# EAGLE schematic STorM32 NT BGC v330m (EAGLE 7.5.0)
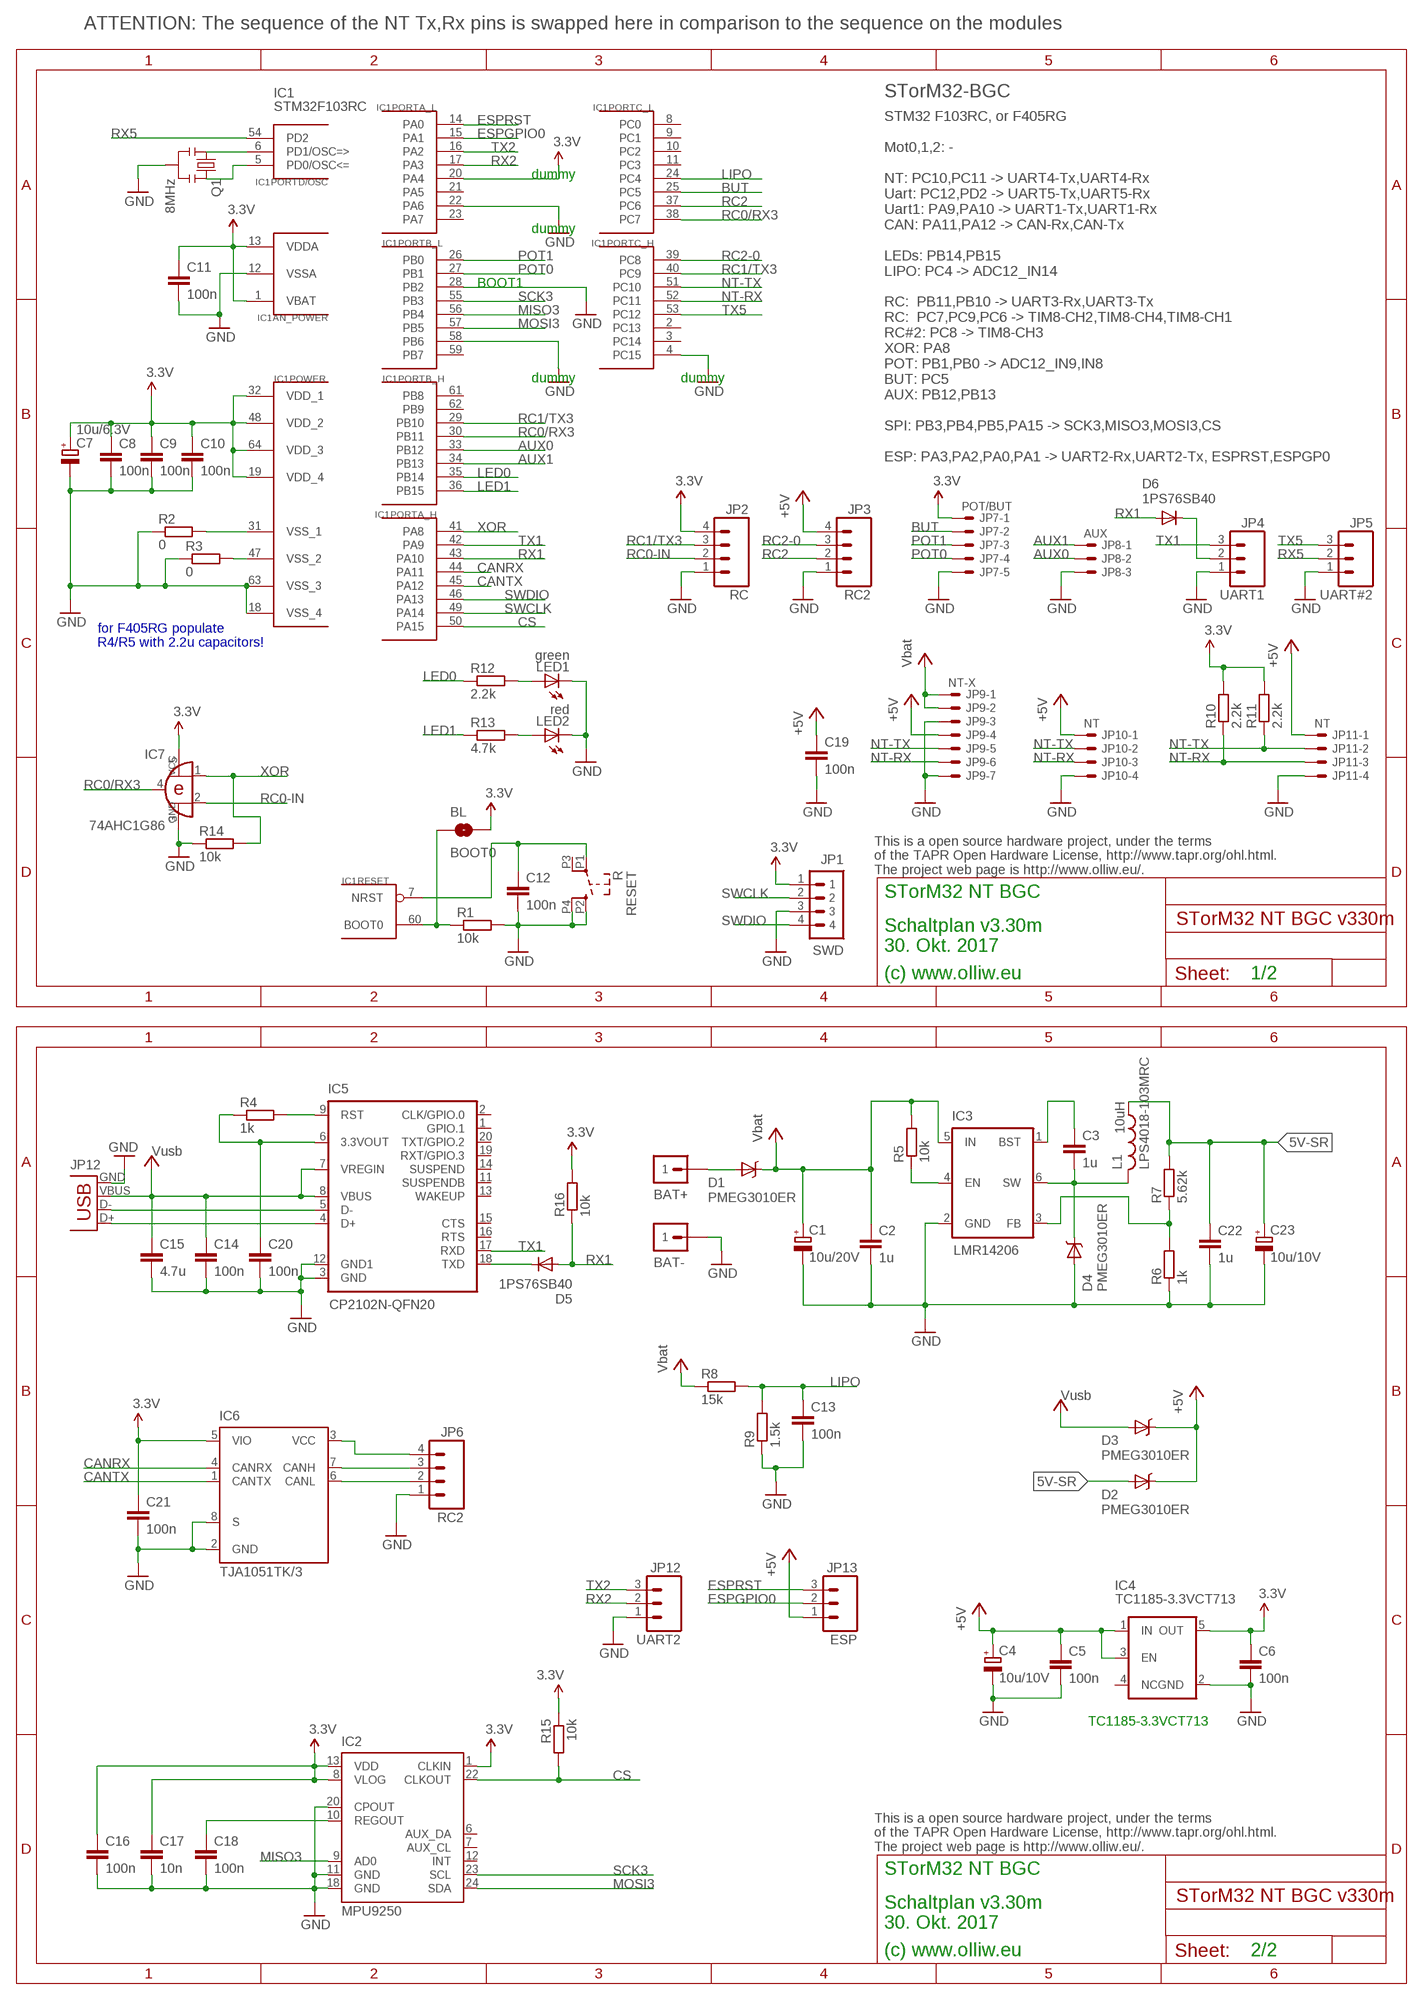
[diagram p0: schematic, sheet 1]

## Parts
BAT+  M1X1  [1X1_WITHOUT]
BAT-  M1X1  [1X1_WITHOUT]
BL  BOOT0  SOLDERJUMPERNO  [SJ_2S-NO]
C1  10u/20V  CPOL-EUSMCB  [SMC_B]
C2  1u  C-EUC0603  [C0603]
C3  1u  C-EUC0603  [C0603]
C4  10u/10V  CPOL-EUSMCA  [SMC_A]
C5  100n  C-EUC0603  [C0603]
C6  100n  C-EUC0402  [C0402]
C7  10u/6.3V  CPOL-EUSMCA  [SMC_A]
C8  100n  C-EUC0402  [C0402]
C9  100n  C-EUC0402  [C0402]
C10  100n  C-EUC0402  [C0402]
C11  100n  C-EUC0402  [C0402]
C12  100n  C-EUC0402  [C0402]
C13  100n  C-EUC0402  [C0402]
C14  100n  C-EUC0402  [C0402]
C15  4.7u  C-EUC0603  [C0603]
C16  100n  C-EUC0402  [C0402]
C17  10n  C-EUC0402  [C0402]
C18  100n  C-EUC0402  [C0402]
C19  100n  C-EUC0402  [C0402]
C20  100n  C-EUC0402  [C0402]
C21  100n  C-EUC0402  [C0402]
C22  1u  C-EUC0603  [C0603]
C23  10u/10V  CPOL-EUSMCA  [SMC_A]
D1  PMEG3010ER  DIODE-SCHOTTKYSOD123-W  [SOD123W-DIODE]
D2  PMEG3010ER  DIODE-SCHOTTKYSOD123-W  [SOD123W-DIODE]
D3  PMEG3010ER  DIODE-SCHOTTKYSOD123-W  [SOD123W-DIODE]
D4  PMEG3010ER  DIODE-SCHOTTKYSOD123-W  [SOD123W-DIODE]
D5  1PS76SB40  DIODE-SOD110-R  [SOD110-R]
D6  1PS76SB40  DIODE-SOD110-R  [SOD110-R]
IC1  STM32F103RCT6  STM32F10XRXT6  [TQFP64]
IC2  MPU9250  IMU3000QFN-24-0.4MIL  [QFN-24-3X3]
IC3  LMR14206  MP2359  [SOT23-6]
IC4  TC1185-3.3VCT713  V_REG_TPS76433SOT23-5  [SOT23-5]
IC5  CP2102N-QFN20  [QFN20-CP2102N]
IC6  TJA1051TK/3  [HVSON8]
IC7  74AHC1G86  [SOT23-5-VER1]
JP1  SWD  P4X1_1P27-OCT_BILEX  [4X1_1P27_OCT_BILEX]
JP2  RC  M041X04_NO_SILK  [1X04_NO_SILK]
JP3  RC2  M041X04_NO_SILK  [1X04_NO_SILK]
JP4  UART1  M031X03_NO_SILK  [1X03_NO_SILK]
JP5  UART#2  M031X03_NO_SILK  [1X03_NO_SILK]
JP6  RC2  M041X04_NO_SILK  [1X04_NO_SILK]
JP7  POT/BUT  SM05B-SRSS-TB  [SM05B-SRSS-TB]
JP8  AUX  SM03B-SRSS-TB  [SM03B-SRSS-TB]
JP9  NT-X  SM07B-SRSS-TB  [SM07B-SRSS-TB]
JP10  NT  SM04B-SRSS-TB  [SM04B-SRSS-TB]
JP11  NT  SM04B-SRSS-TB  [SM04B-SRSS-TB]
JP12  UART2  M031X03_NO_SILK  [1X03_NO_SILK]
JP13  ESP  M031X03_NO_SILK  [1X03_NO_SILK]
L1  LPS4018-103MRC  L  [L4X4]
LED1  green  LEDCHIPLED_0603  [CHIPLED_0603]
LED2  red  LEDCHIPLED_0603  [CHIPLED_0603]
Q1  8MHz  RESONATORSMD  [RESONATOR-SMD]
R1  10k  R-EU_R0402  [R0402]
R2  0  R-EU_R0402  [R0402]
R3  0  R-EU_R0402  [R0402]
R4  1k  R-EU_R0402  [R0402]
R5  10k  R-EU_R0402  [R0402]
R6  1k  R-EU_R0402  [R0402]
R7  5.62k  R-EU_R0402  [R0402]
R8  15k  R-EU_R0402  [R0402]
R9  1.5k  R-EU_R0402  [R0402]
R10  2.2k  R-EU_R0402  [R0402]
R11  2.2k  R-EU_R0402  [R0402]
R12  2.2k  R-EU_R0402  [R0402]
R13  4.7k  R-EU_R0402  [R0402]
R14  10k  R-EU_R0402  [R0402]
R15  10k  R-EU_R0402  [R0402]
R16  10k  R-EU_R0402  [R0402]
RESET  R  SWITCH-SMD-RIGHT-TL1014  [TACTILE-SWITCH-SMD-RIGHT-TL1014]
USB  Amphenol 10118192-0001LF  USB-MICROB  [USB-MICROB]

## Nets
3.3V: BL.2 C6.1 C7.+ C8.1 C9.1 C10.1 C11.1 C16.1 C17.1 C21.1 IC1.1(AN_POWER:VBAT) IC1.13(AN_POWER:VDDA) IC1.19(POWER:VDD_4) IC1.20(PORTA_L:PA4) IC1.32(POWER:VDD_1) IC1.48(POWER:VDD_2) IC1.64(POWER:VDD_3) IC2.1(CLKIN) IC2.8(VLOG) IC2.13(VDD) IC4.5(OUT) IC6.5(VIO) IC7.5(VCC) JP1.1 JP2.4 JP7.1 R10.2 R11.2 R15.1 R16.2
3.3V-CP2102: C20.1 IC5.6(3.3VOUT) R4.1
5V-CAN-RAW: IC6.3(VCC) JP6.4
5V-SR: C22.1 C23.+ D2.A L1.1 R7.2
+5V: C4.+ C5.1 C19.1 D2.C D3.C IC4.1(IN) IC4.3(EN) JP3.4 JP9.4 JP10.1 JP11.1 JP13.1
AUX0: IC1.33(PORTB_H:PB12) JP8.2
AUX1: IC1.34(PORTB_H:PB13) JP8.1
BATP: BAT+.1 D1.A
BOOT0: BL.1 IC1.60(RESET:BOOT0) R1.1
BUT: IC1.25(PORTC_L:PC5) JP7.2
CANH: IC6.7(CANH) JP6.3
CANL: IC6.6(CANL) JP6.2
CANRX: IC1.44(PORTA_H:PA11) IC6.4(CANRX)
CANTX: IC1.45(PORTA_H:PA12) IC6.1(CANTX)
CS: IC1.50(PORTA_H:PA15) IC2.22(CLKOUT) R15.2
ESPGPIO0: IC1.15(PORTA_L:PA1) JP13.2
ESPRST: IC1.14(PORTA_L:PA0) JP13.3
GND: BAT-.1 C1.- C2.2 C4.- C5.2 C6.2 C7.- C8.2 C9.2 C10.2 C11.2 C12.2 C13.2 C14.2 C15.2 C16.2 C17.2 C18.2 C19.2 C20.2 C21.2 C22.2 C23.- D4.A IC1.4(PORTC_H:PC15) IC1.12(AN_POWER:VSSA) IC1.18(POWER:VSS_4) IC1.22(PORTA_L:PA6) IC1.28(PORTB_L:PB2) IC1.58(PORTB_L:PB6) IC1.63(POWER:VSS_3) IC2.11(GND) IC2.18(GND) IC2.20(CPOUT) IC3.2(GND) IC4.2(GND) IC5.3(GND) IC5.12(GND1) IC6.2(GND) IC6.8(S) IC7.3(GND) JP1.3 JP2.1 JP3.1 JP4.1 JP5.1 JP6.1 JP7.5 JP8.3 JP9.3 JP9.7 JP10.4 JP11.4 JP12.1 LED1.C LED2.C Q1.2 R1.2 R2.1 R3.1 R6.1 R9.1 R14.1 RESET.P2 RESET.P4 USB.GND
LED0: IC1.35(PORTB_H:PB14) R12.1
LED1: IC1.36(PORTB_H:PB15) R13.1
LIPO: C13.1 IC1.24(PORTC_L:PC4) R8.2 R9.2
MISO3: IC1.56(PORTB_L:PB4) IC2.9(AD0)
MOSI3: IC1.57(PORTB_L:PB5) IC2.24(SDA)
N$5: IC5.5(D-) USB.D-
N$6: IC5.4(D+) USB.D+
N$7: IC3.4(EN) R5.1
N$8: LED1.A R12.2
N$9: LED2.A R13.2
N$10: IC1.47(POWER:VSS_2) R3.2
N$11: IC1.5(PORTD/OSC:PD0/OSC<=) Q1.3
N$12: IC1.6(PORTD/OSC:PD1/OSC=>) Q1.1
N$13: C3.1 IC3.1(BST)
N$14: IC3.3(FB) R6.2 R7.1
N$15: C3.2 D4.C IC3.6(SW) L1.2
N$16: D5.C IC5.18(TXD)
N$17: D6.C JP4.2
N$18: IC5.9(RST) R4.2
N$26: IC1.31(POWER:VSS_1) R2.2
NRST: C12.1 IC1.7(RESET:NRST) RESET.P1
NT-RX: IC1.52(PORTC_H:PC11) JP9.6 JP10.3 JP11.3 R10.1
NT-TX: IC1.51(PORTC_H:PC10) JP9.5 JP10.2 JP11.2 R11.1
POT0: IC1.27(PORTB_L:PB1) JP7.4
POT1: IC1.26(PORTB_L:PB0) JP7.3
RC0-IN: IC7.2(I1) JP2.2
RC0/RX3: IC1.30(PORTB_H:PB11) IC1.38(PORTC_L:PC7) IC7.4(O)
RC1/TX3: IC1.29(PORTB_H:PB10) IC1.40(PORTC_H:PC9) JP2.3
RC2: IC1.37(PORTC_L:PC6) JP3.2
RC2-0: IC1.39(PORTC_H:PC8) JP3.3
REGOUT: C18.1 IC2.10(REGOUT)
RX1: D5.A D6.A IC1.43(PORTA_H:PA10) R16.1
RX2: IC1.17(PORTA_L:PA3) JP12.2
RX5: IC1.54(PORTD/OSC:PD2) JP5.2
SCK3: IC1.55(PORTB_L:PB3) IC2.23(SCL)
SWCLK: IC1.49(PORTA_H:PA14) JP1.2
SWDIO: IC1.46(PORTA_H:PA13) JP1.4
TX1: IC1.42(PORTA_H:PA9) IC5.17(RXD) JP4.3
TX2: IC1.16(PORTA_L:PA2) JP12.3
TX5: IC1.53(PORTC_H:PC12) JP5.3
VCC: C1.+ C2.1 D1.C IC3.5(IN) JP9.1 JP9.2 R5.2 R8.1 ; supply symbol labelled Vbat
VUSB: C14.1 C15.1 D3.A IC5.7(VREGIN) IC5.8(VBUS) USB.VBUS ; supply symbol labelled Vusb
XOR: IC1.41(PORTA_H:PA8) IC7.1(I0) R14.2
Unconnected: IC1.2(PORTC_H:PC13) IC1.3(PORTC_H:PC14) IC1.8(PORTC_L:PC0) IC1.9(PORTC_L:PC1) IC1.10(PORTC_L:PC2) IC1.11(PORTC_L:PC3) IC1.21(PORTA_L:PA5) IC1.23(PORTA_L:PA7) IC1.59(PORTB_L:PB7) IC1.61(PORTB_H:PB8) IC1.62(PORTB_H:PB9) IC2.6(AUX_DA) IC2.7(AUX_CL) IC2.12(INT) IC4.4(NC) IC5.1(GPIO.1) IC5.2(CLK/GPIO.0) IC5.11(SUSPENDB) IC5.13(WAKEUP) IC5.14(SUSPEND) IC5.15(CTS) IC5.16(RTS) IC5.19(RXT/GPIO.3) IC5.20(TXT/GPIO.2) RESET.P3

## Notes on the sheet
- ATTENTION: The sequence of the NT Tx,Rx pins is swapped here in comparison to the sequence on the modules
- IC1 | STorM32-BGC
- STM32F103RC
- STM32 F103RC, or F405RG
  
  Mot0,1,2: -
  
  NT: PC10,PC11 -> UART4-Tx,UART4-Rx
  Uart: PC12,PD2 -> UART5-Tx,UART5-Rx
  Uart1: PA9,PA10 -> UART1-Tx,UART1-Rx
  CAN: PA11,PA12 -> CAN-Rx,CAN-Tx
  
  LEDs: PB14,PB15
  LIPO: PC4 -> ADC12_IN14
  
  RC:  PB11,PB10 -> UART3-Rx,UART3-Tx
  RC:  PC7,PC9,PC6 -> TIM8-CH2,TIM8-CH4,TIM8-CH1
  RC#2: PC8 -> TIM8-CH3
  XOR: PA8
  POT: PB1,PB0 -> ADC12_IN9,IN8
  BUT: PC5
  AUX: PB12,PB13
  
  SPI: PB3,PB4,PB5,PA15 -> SCK3,MISO3,MOSI3,CS
  
  ESP: PA3,PA2,PA0,PA1 -> UART2-Rx,UART2-Tx, ESPRST,ESPGP0
- dummy
- dummy
- BOOT1
- dummy | dummy
- for F405RG populate
  R4/R5 with 2.2u capacitors!
- This is a open source hardware project, under the terms
  of the TAPR Open Hardware License, http://www.tapr.org/ohl.html.
  The project web page is http://www.olliw.eu/.
- STorM32 NT BGC
- Schaltplan v3.30m
  30. Okt. 2017
- (c) www.olliw.eu | 1/2
- 10uH
- JP12
- TC1185-3.3VCT713
- This is a open source hardware project, under the terms
  of the TAPR Open Hardware License, http://www.tapr.org/ohl.html.
  The project web page is http://www.olliw.eu/.
- STorM32 NT BGC
- Schaltplan v3.30m
  30. Okt. 2017
- (c) www.olliw.eu | 2/2

## Library data of the parts
BAT+ BAT- = # stdlib:M1X1
BL = # SparkFun2:SOLDERJUMPER: Solder Jumper Standard SMD solder jumper. Used to automate production. Two varients : Normally Open and Normally Closed are the same, but have different paste layers. NC will have a large amount of paste and should jumper during reflow.
C1 C4 C7 C23 = rcl:CPOL-EU: POLARIZED CAPACITOR, European symbol
C2 C3 C5 C6 C8-C22 = rcl:C-EU: CAPACITOR, European symbol
D1-D4 = # stdlib:DIODE-SCHOTTKY
D5 D6 = diode:DIODE-: DIODE
IC1 = # stm32:STM32F10XRXT6: STM32F101/103 64pin LQFP
IC2 = # SparkFun2:IMU3000
IC3 = # stdlib:MP2359
IC4 = # SparkFun2:V_REG_TPS76433: Voltage Regulator Older TI part. LDO 150mA regulator. No output by-pass cap option. See V_REG_LDO for a better part.
IC5 = # stdlib:CP2102N-QFN20
IC6 = # stdlib:TJA1051TK/3
IC7 = # stdlib:74AHC1G86
JP1 = # stdlib:P4X1_1P27
JP2 JP3 JP6 = # SparkFun2:M04: Header 4 Standard 4-pin 0.1" header. Use with straight break away headers (SKU : PRT-00116), right angle break away headers (PRT-00553), swiss pins (PRT-00743), machine pins (PRT-00117), and female headers (PRT-00115). Molex polarized connector foot print use with SKU : PRT-08231 with associated crimp pins and housings. 1MM SMD Version SKU: PRT-10208
JP4 JP5 JP12 JP13 = # SparkFun2:M03: Header 3 Standard 3-pin 0.1" header. Use with straight break away headers (SKU : PRT-00116), right angle break away headers (PRT-00553), swiss pins (PRT-00743), machine pins (PRT-00117), and female headers (PRT-00115). Molex polarized connector foot print use with SKU : PRT-08232 with associated crimp pins and housings.
JP7 = con-jst2:?M05B-SRSS-TB: Disconnectable Crimp style connector, 1.0mm pitch 5 contacts
JP8 = con-jst2:?M03B-SRSS-TB: Disconnectable Crimp style connector, 1.0mm pitch 3 contacts
JP9 = con-jst2:?M07B-SRSS-TB: Disconnectable Crimp style connector, 1.0mm pitch 7 contacts
JP10 JP11 = con-jst2:?M04B-SRSS-TB: Disconnectable Crimp style connector, 1.0mm pitch 4 contacts
L1 = # stdlib:L
LED1 LED2 = led:LED: LED OSRAM: - CHIPLED LG R971, LG N971, LY N971, LG Q971, LY Q971, LO R971, LY R971 LH N974, LH R974 LS Q976, LO Q976, LY Q976 LO Q996 - Hyper CHIPLED LW Q18S LB Q993, LB Q99A, LB R99A - SideLED LS A670, LO A670, LY A670, LG A670, LP A670 LB A673, LV A673, LT A673, LW A673 LH A674 LY A675 LS A676, LA A676, LO A676, LY A676, LW A676 LS A679, LY A679, LG A679 - Hyper Micro SIDELED® LS Y876, LA Y876, LO Y876, LY Y876 LT Y87S - SmartLED LW L88C, LW L88S LB L89C, LB L89S, LG L890 LS L89K, LO L89K, LY L89K LS L896, LA L896, LO L896, LY L896 - TOPLED LS T670, LO T670, LY T670, LG T670, LP T670 LSG T670, LSP T670, LSY T670, LOP T670, LYG T670 LG T671, LOG T671, LSG T671 LB T673, LV T673, LT T673, LW T673 LH T674 LS T676, LA T676, LO T676, LY T676, LB T676, LH T676, LSB T676, LW T676 LB T67C, LV T67C, LT T67C, LS T67K, LO T67K, LY T67K, LW E67C LS E67B, LA E67B, LO E67B, LY E67B, LB E67C, LV E67C, LT E67C LW T67C LS T679, LY T679, LG T679 LS T770, LO T770, LY T770, LG T770, LP T770 LB T773, LV T773, LT T773, LW T773 LH T774 LS E675, LA E675, LY E675, LS T675 LS T776, LA T776, LO T776, LY T776, LB T776 LHGB T686 LT T68C, LB T68C - Hyper Mini TOPLED® LB M676 - Mini TOPLED Santana® LG M470 LS M47K, LO M47K, LY M47K Source: http://www.osram.convergy.de LUXEON: - LUMILED® LXK2-PW12-R00, LXK2-PW12-S00, LXK2-PW14-U00, LXK2-PW14-V00 LXK2-PM12-R00, LXK2-PM12-S00, LXK2-PM14-U00 LXK2-PE12-Q00, LXK2-PE12-R00, LXK2-PE12-S00, LXK2-PE14-T00, LXK2-PE14-U00 LXK2-PB12-K00, LXK2-PB12-L00, LXK2-PB12-M00, LXK2-PB14-N00, LXK2-PB14-P00, LXK2-PB14-Q00 LXK2-PR12-L00, LXK2-PR12-M00, LXK2-PR14-Q00, LXK2-PR14-R00 LXK2-PD12-Q00, LXK2-PD12-R00, LXK2-PD12-S00 LXK2-PH12-R00, LXK2-PH12-S00 LXK2-PL12-P00, LXK2-PL12-Q00, LXK2-PL12-R00 Source: www.luxeon.com KINGBRIGHT: KA-3528ASYC Source: www.kingbright.com
Q1 = # SparkFun2:RESONATOR: Resonator Small SMD resonator. This is the itty bitty 10/20MHz resonators with built in caps. CSTCE10M0G55 and CSTCE20M0V53. Footprint has been reviewed closely but hasn't been tested yet.
R1-R16 = rcl:R-EU_: RESISTOR, European symbol
RESET = # stdlib:SWITCH-SMD-RIGHT-TL1014
USB = # SparkFun2:USB: USB Connectors USB-B-PTH is fully proven SKU : PRT-00139 USB-miniB is fully proven SKU : PRT-00587 USB-A-PCB is untested. USB-A-H is throughly reviewed, but untested. Spark Fun Electronics SKU : PRT-00437 USB-B-SMT is throughly reviewed, but untested. Needs silkscreen touching up. USB-A-S has not been used/tested USB-MB-H has not been used/tested